# EAGLE design Carrier Board (EAGLE 9.5.1)

## Sheet 1 of 3: Sensors
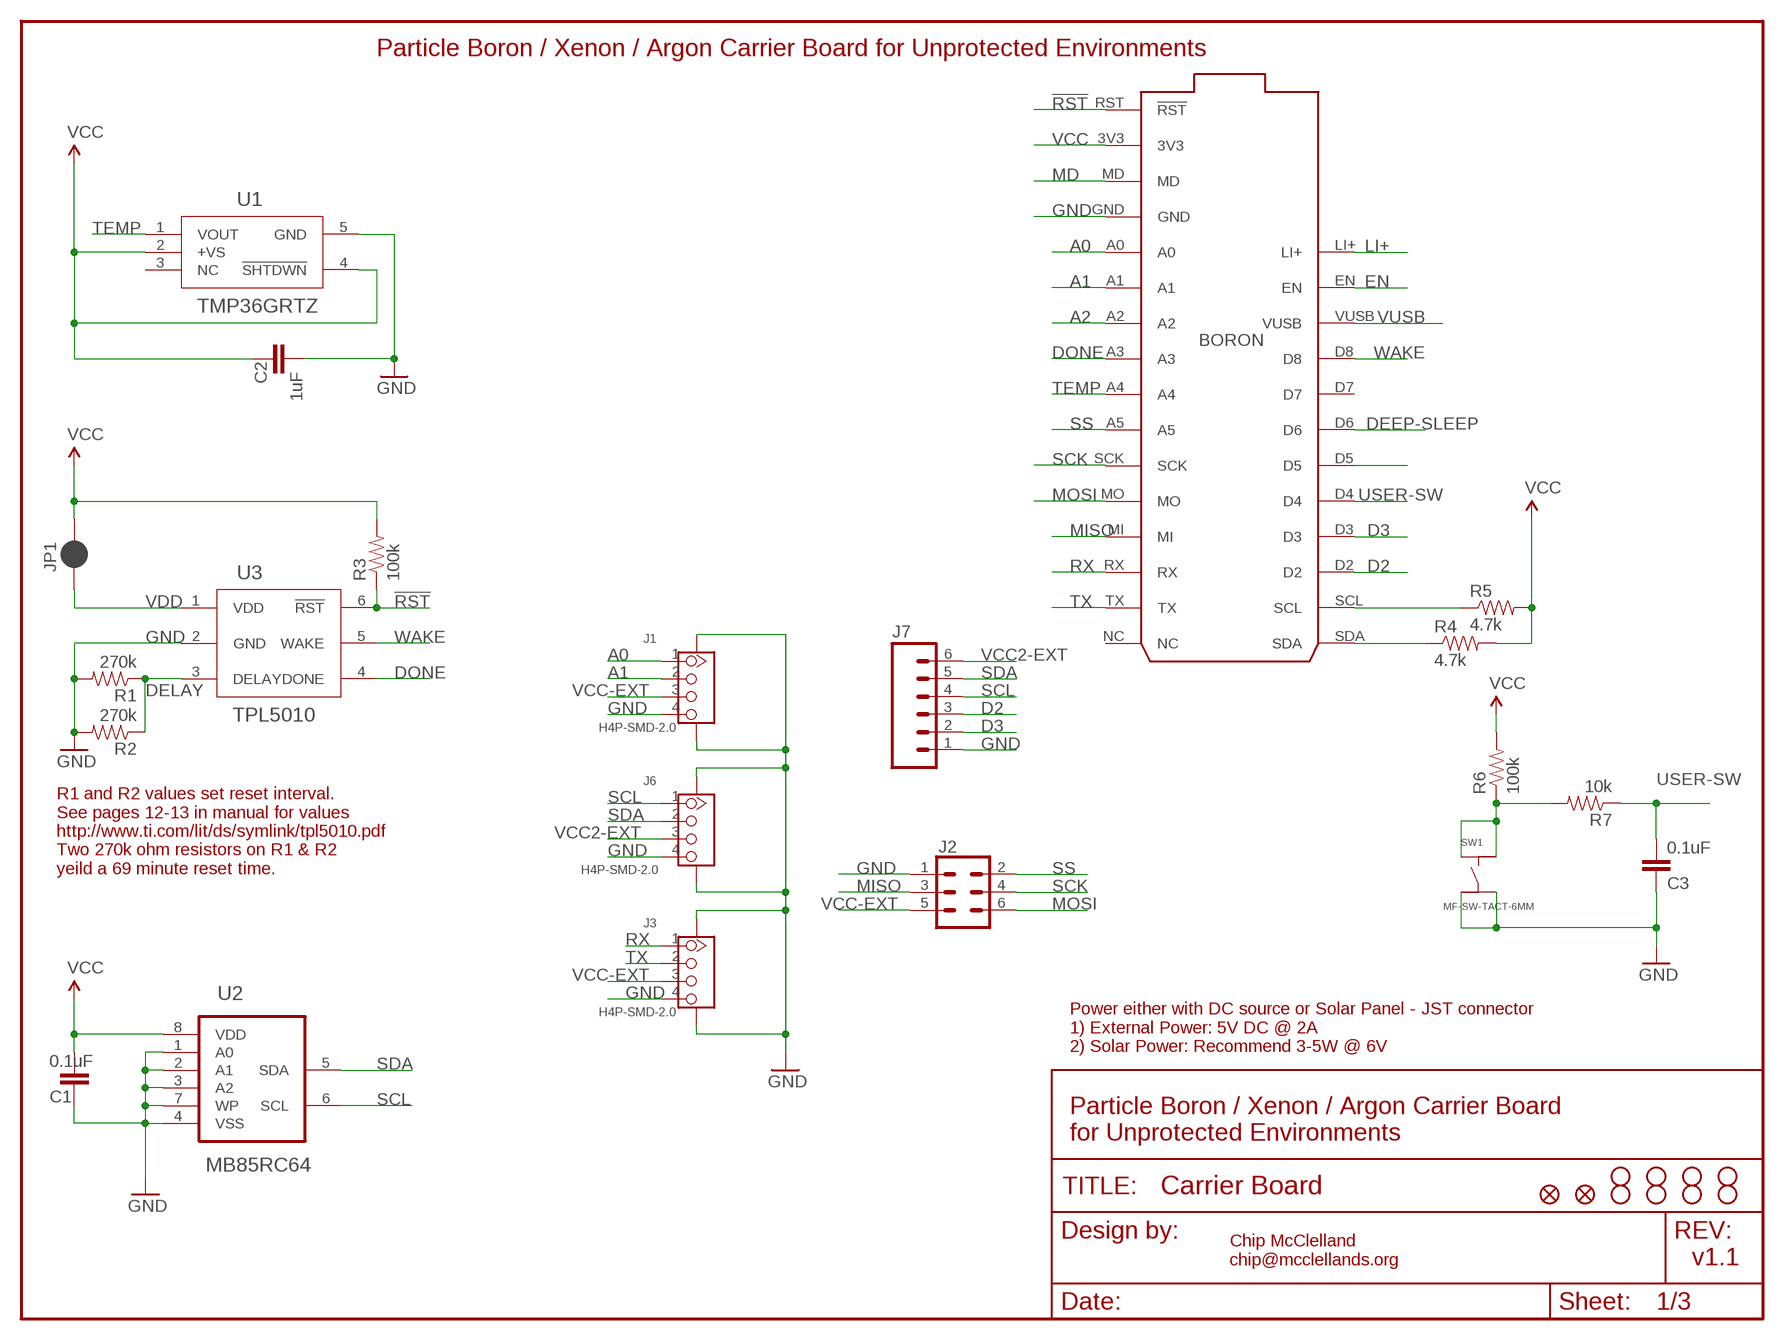
[diagram p0: schematic, sheet 1]

### Parts
C1  0.1uF  CAP0805  [0805@1]
C2  1uF  CAP0805  [0805@1]
C3  0.1uF  CAP0805  [0805@1]
FD1  FIDUCIALUFIDUCIAL  [FIDUCIAL-MICRO]
FD2  FIDUCIALUFIDUCIAL  [FIDUCIAL-MICRO]
FRAME1  FRAME-LETTER  [CREATIVE_COMMONS]
H1  STAND-OFF-M2.5  [STAND-OFF-M2.5]
H2  STAND-OFF-M2.5  [STAND-OFF-M2.5]
H3  STAND-OFF-M2.5  [STAND-OFF-M2.5]
H4  STAND-OFF-M2.5  [STAND-OFF-M2.5]
J1  H4P-SMD-2.0  GROVE-CONNECTOR-SMD(4+2P-2.0)  [HW4-SMD-2.0]
J2  CONN_03X22X3_SILK_MALE_PTH  [2X3]
J3  H4P-SMD-2.0  GROVE-CONNECTOR-SMD(4+2P-2.0)  [HW4-SMD-2.0]
J6  H4P-SMD-2.0  GROVE-CONNECTOR-SMD(4+2P-2.0)  [HW4-SMD-2.0]
J7  M06LOCK  [1X06_LOCK]
JP1  JUMPER-SMT_2_NC_PASTE_SILK  [SMT-JUMPER_2_NC_PASTE_SILK]
JP3  STAND-OFF  [STAND-OFF]
JP4  STAND-OFF  [STAND-OFF]
JP5  STAND-OFF  [STAND-OFF]
JP6  STAND-OFF  [STAND-OFF]
P1  PARTICLE-DEVICES-BORON  [PARTICLE-DEVICES_BORON]
R1  270k  RESISTOR0805-RES  [0805]
R2  270k  RESISTOR0805-RES  [0805]
R3  100k  RESISTOR0805-RES  [0805]
R4  4.7k  RESISTOR0805-RES  [0805]
R5  4.7k  RESISTOR0805-RES  [0805]
R6  100k  RESISTOR0805-RES  [0805]
R7  10k  RESISTOR0805-RES  [0805]
SW1  MF-SW-TACT-6MM  TACT_6MM  [TACT6MM]
U1  TMP36GRTZ  TMP36GRTZ-REEL7  [RJ_5]
U2  MB85RC64  MB85RC128PNF-G-JNE1  [SOIC127P600X175-8N]
U3  TPL5010  [TSOT-23]

### Nets
!RST: P1.RST(!RST) R3.1 U3.6(!RST)
A0: J1.1 P1.A0
A1: J1.2 P1.A1
A2: P1.A2
D2: J7.3 P1.D2 ; also sheet 2
D3: J7.2 P1.D3 ; also sheet 2
DEEP-SLEEP: P1.D6 ; also sheet 3
DELAY: R1.1 R2.1 U3.3(DELAY)
DONE: P1.A3 U3.4(DONE)
EN: P1.EN ; also sheet 3
GND: C1.2 C2.2 C3.2 J1.4 J1.SS1 J1.SS2 J2.1 J3.4 J3.SS1 J3.SS2 J6.4 J6.SS1 J6.SS2 J7.1 P1.GND R1.2 R2.2 SW1.P$3 SW1.P$4 U1.5(GND) U2.1(A0) U2.2(A1) U2.3(A2) U2.4(VSS) U2.7(WP) U3.2(GND) ; also sheet 2,3
LI+: P1.LI+ ; also sheet 2,3
MD: P1.MD
MISO: J2.3 P1.MI
MOSI: J2.6 P1.MO
N$2: P1.D5
N$4: R6.1 R7.2 SW1.P$1 SW1.P$2
RX: J3.1 P1.RX
SCK: J2.4 P1.SCK
SCL: J6.1 J7.4 P1.SCL R5.1 U2.6(SCL) ; also sheet 2,3
SDA: J6.2 J7.5 P1.SDA R4.1 U2.5(SDA) ; also sheet 2,3
SS: J2.2 P1.A5
TEMP: P1.A4 U1.1(VOUT)
TX: J3.2 P1.TX
USER-SW: C3.1 P1.D4 R7.1
VCC: C1.1 C2.1 JP1.2 P1.3V3 R3.2 R4.2 R5.2 R6.2 U1.2(+VS) U1.4(!SHTDWN) U2.8(VDD) ; also sheet 2,3
VCC2-EXT: J6.3 J7.6 ; also sheet 2
VCC-EXT: J1.3 J2.5 J3.3 ; also sheet 2
VDD: JP1.1 U3.1(VDD)
VUSB: P1.VUSB ; also sheet 2
WAKE: P1.D8 U3.5(WAKE)
Unconnected: P1.D7 P1.NC U1.3(NC)

### Notes on the sheet
- Particle Boron / Xenon / Argon Carrier Board for Unprotected Environments
- R1 and R2 values set reset interval.
  See pages 12-13 in manual for values
  http://www.ti.com/lit/ds/symlink/tpl5010.pdf
  Two 270k ohm resistors on R1 & R2 
  yeild a 69 minute reset time.
- Power either with DC source or Solar Panel - JST connector
  1) External Power: 5V DC @ 2A 
  2) Solar Power: Recommend 3-5W @ 6V
- Particle Boron / Xenon / Argon Carrier Board
  for Unprotected Environments
- Chip McClelland
  chip@mcclellands.org
- v1.1

## Sheet 2 of 3: Power Control
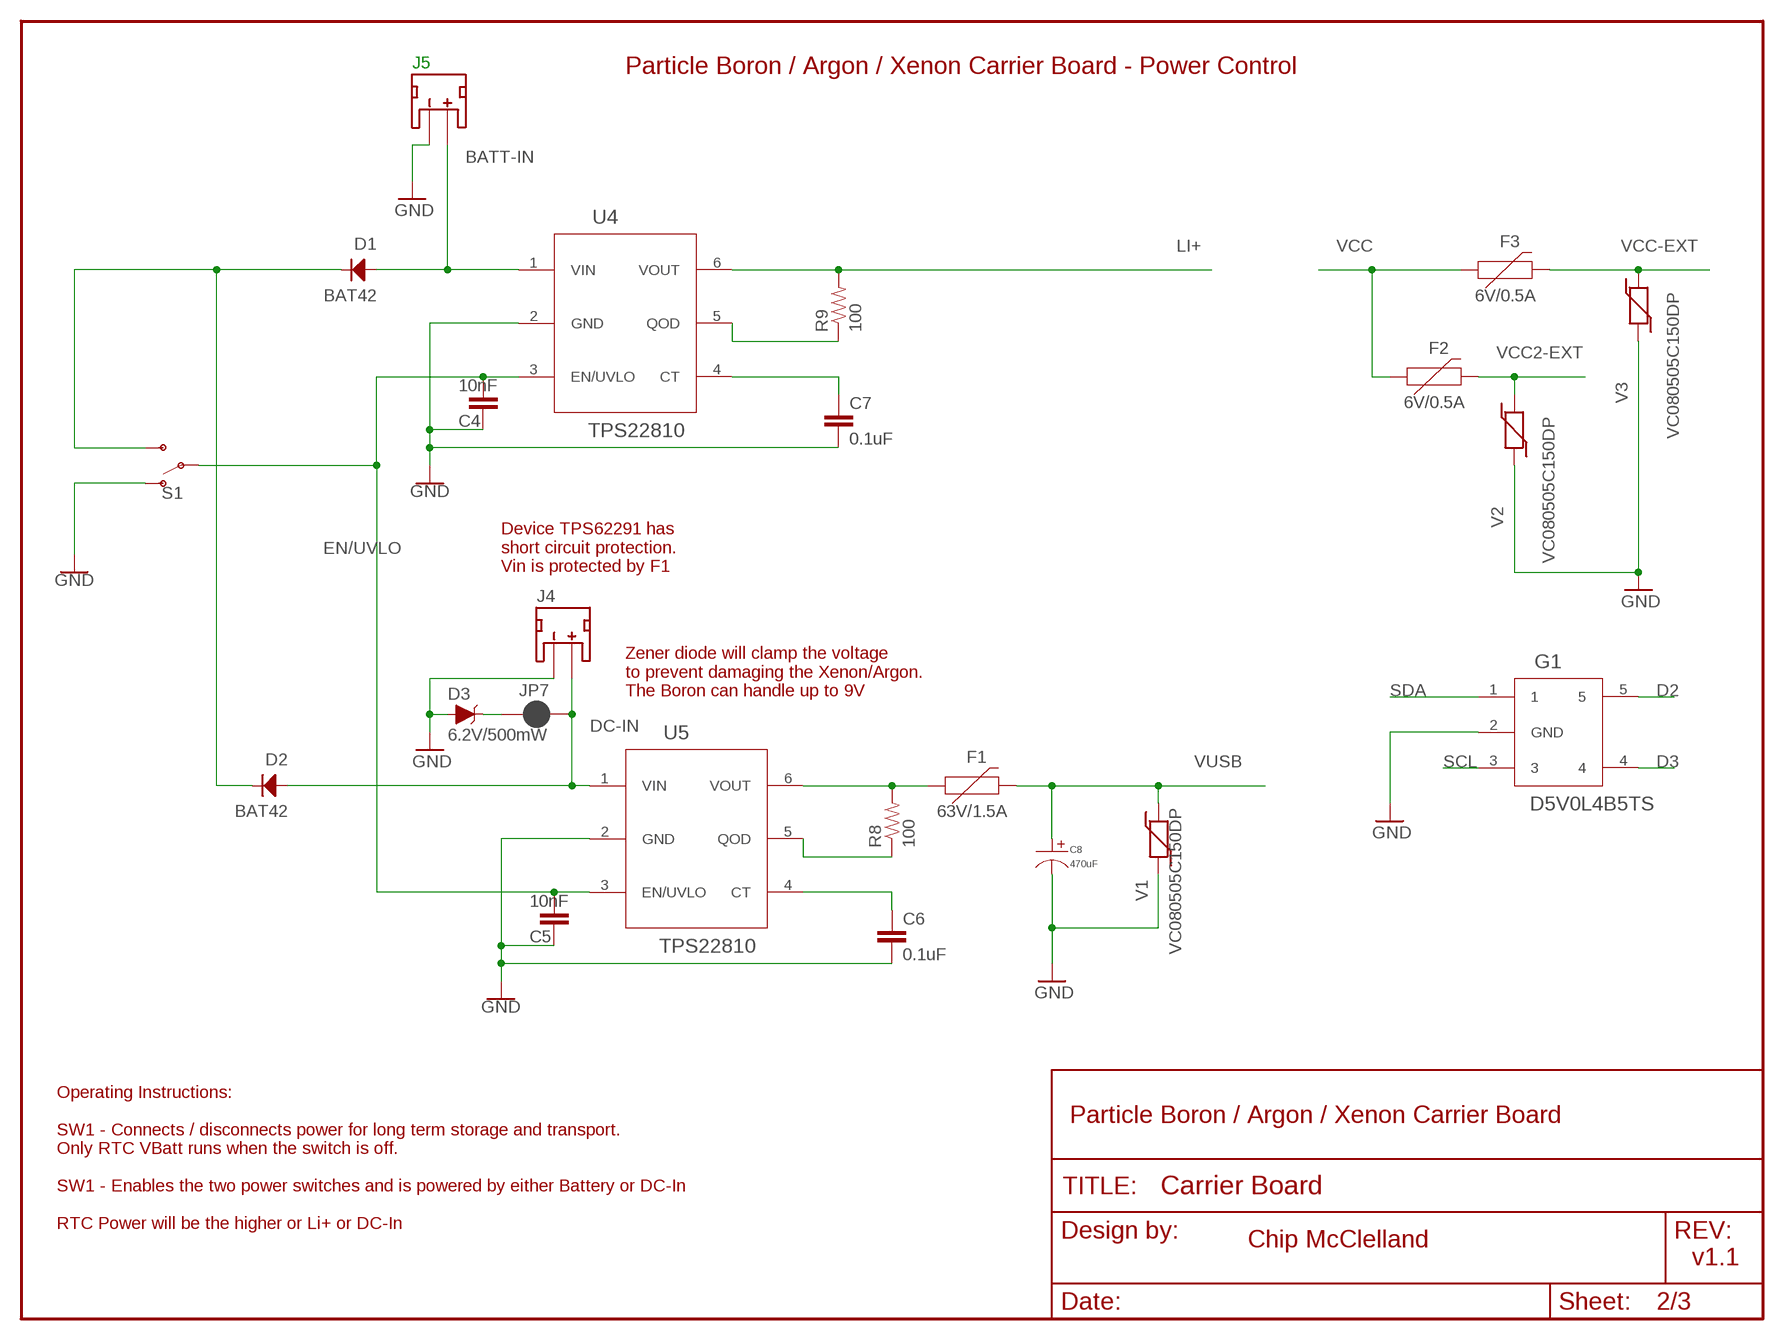
[diagram p1: schematic, sheet 2]

### Parts
C4  10nF  CAP0805  [0805@1]
C5  10nF  CAP0805  [0805@1]
C6  0.1uF  CAP0805  [0805@1]
C7  0.1uF  CAP0805  [0805@1]
C8  470uF  CAPACITOR_P_10MM  [CP10MM]
D1  BAT42  DIODES_BAT42_SOD-123  [SOD-123]
D2  BAT42  DIODES_BAT42_SOD-123  [SOD-123]
D3  6.2V/500mW  DIODE-ZENER-DZ2J150M0L  [PANASONIC_SMINI2-F5-B]
F1  63V/1.5A  PPTC_HALF-AMP  [1206]
F2  6V/0.5A  PPTC_HALF-AMP  [1206]
F3  6V/0.5A  PPTC_HALF-AMP  [1206]
FRAME2  FRAME-LETTER  [CREATIVE_COMMONS]
G1  D5V0L4B5TS  [SOT-23-5]
J4  S2B-PH-SM4-TB(LF)(SN)  JST_2MM_MALE  [JST-2-SMD]
J5  S2B-PH-SM4-TB(LF)(SN)  JST_2MM_MALE  [JST-2-SMD]
JP7  JUMPER-SMT_2_NC_PASTE_SILK  [SMT-JUMPER_2_NC_PASTE_SILK]
R8  100  RESISTOR0805-RES  [0805]
R9  100  RESISTOR0805-RES  [0805]
S1  SWITCH-SPDT-SMD-AYZ0202  [SWITCH_DPDT_SMD_AYZ0202]
U4  TPS22810  [SOT-23-6]
U5  TPS22810  [SOT-23-6]
V1  VC080505C150DP  VARISTOR  [0805]
V2  VC080505C150DP  VARISTOR  [0805]
V3  VC080505C150DP  VARISTOR  [0805]

### Nets
BATT-IN: D1.ANODE J5.2(+) U4.1(VIN) ; also sheet 3
D2: G1.5 ; also sheet 1
D3: G1.4 ; also sheet 1
DC-IN: D2.ANODE J4.2(+) JP7.1 U5.1(VIN)
EN/UVLO: C4.1 C5.1 S1.2(P) U4.3(EN/UVLO) U5.3(EN/UVLO)
GND: C4.2 C5.2 C6.2 C7.2 C8.P$2 D3.A G1.2(GND) J4.1(-) J5.1(-) S1.1(O) U4.2(GND) U5.2(GND) V1.1 V2.1 V3.1 ; also sheet 1,3
LI+: R9.2 U4.6(VOUT) ; also sheet 1,3
N$1: D3.C JP7.2
N$5: C6.1 U5.4(CT)
N$6: R8.1 U5.5(QOD)
N$7: F1.1 R8.2 U5.6(VOUT)
N$9: D1.CATHODE D2.CATHODE S1.3(S)
N$10: C7.1 U4.4(CT)
N$12: R9.1 U4.5(QOD)
SCL: G1.3 ; also sheet 1,3
SDA: G1.1 ; also sheet 1,3
VCC: F2.1 F3.1 ; also sheet 1,3
VCC2-EXT: F2.2 V2.2 ; also sheet 1
VCC-EXT: F3.2 V3.2 ; also sheet 1
VUSB: C8.P$1 F1.2 V1.2 ; also sheet 1
Unconnected: J4.NC1(PAD1) J4.NC2(PAD2) J5.NC1(PAD1) J5.NC2(PAD2)

### Notes on the sheet
- Particle Boron / Argon / Xenon Carrier Board - Power Control
- Device TPS62291 has 
  short circuit protection. 
  Vin is protected by F1
- Zener diode will clamp the voltage
  to prevent damaging the Xenon/Argon.  
  The Boron can handle up to 9V
- Particle Boron / Argon / Xenon Carrier Board
- Operating Instructions:
  
  SW1 - Connects / disconnects power for long term storage and transport.  
  Only RTC VBatt runs when the switch is off.
  
  SW1 - Enables the two power switches and is powered by either Battery or DC-In
  
  RTC Power will be the higher or Li+ or DC-In
- Chip McClelland
- v1.1

## Sheet 3 of 3: Real Time Clock
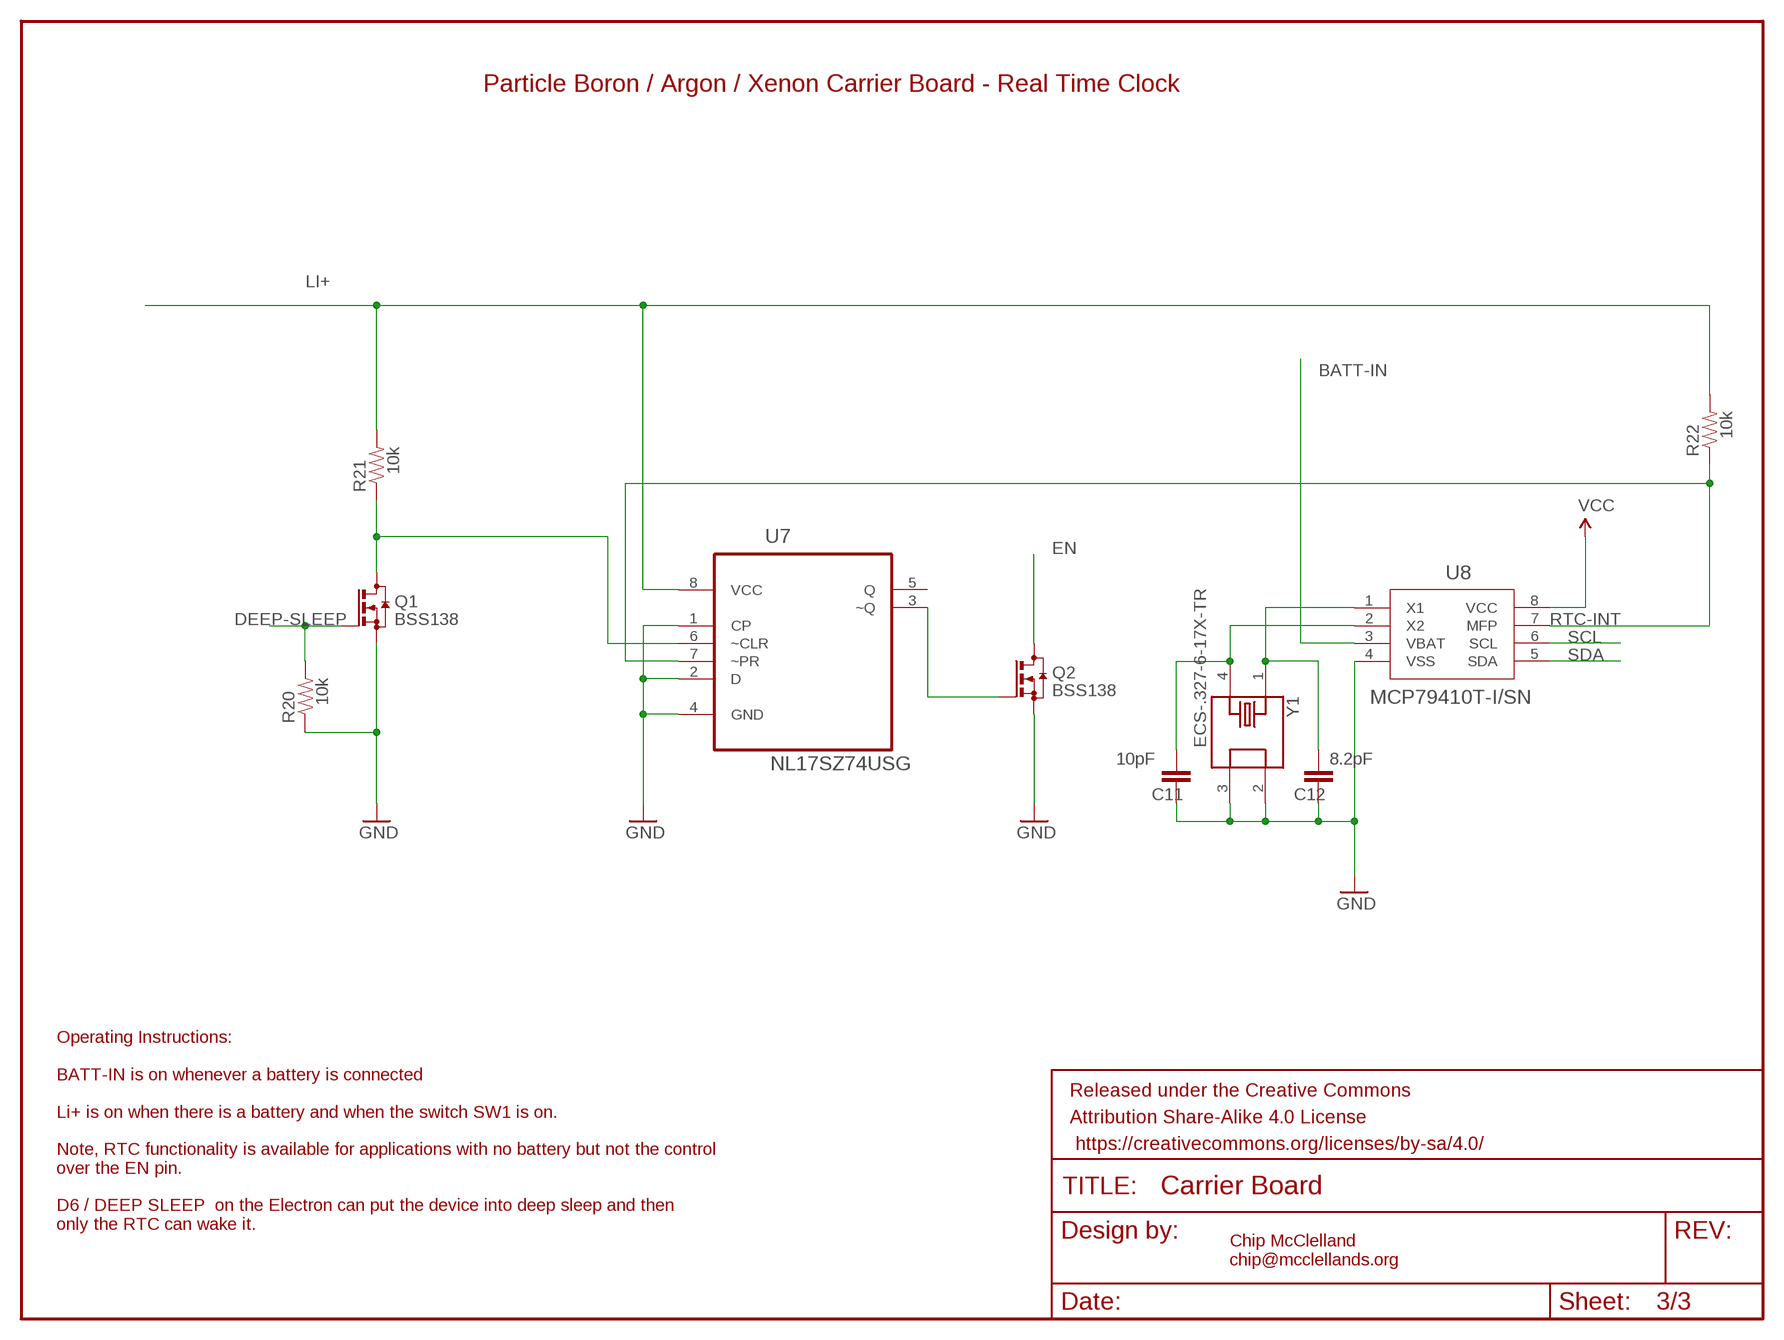
[diagram p2: schematic, sheet 3]

### Parts
C11  10pF  CAP0805  [0805@1]
C12  8.2pF  CAP0805  [0805@1]
FRAME3  FRAME-LETTER  [CREATIVE_COMMONS]
Q1  BSS138  BSS123  [SOT23]
Q2  BSS138  BSS123  [SOT23]
R20  10k  RESISTOR0805-RES  [0805]
R21  10k  RESISTOR0805-RES  [0805]
R22  10k  RESISTOR0805-RES  [0805]
U7  NL17SZ74USG  [SOP50P310X90-8N]
U8  MCP79410T-I/SN  [SOIC8-N_MC]
Y1  ECS-.327-6-17X-TR  [XTAL_ECS-.327-6-17X-TR]

### Nets
BATT-IN: U8.3(VBAT) ; also sheet 2
DEEP-SLEEP: Q1.1(G) R20.2 ; also sheet 1
EN: Q2.3(D) ; also sheet 1
GND: C11.2 C12.2 Q1.2(S) Q2.2(S) R20.1 U7.1(CP) U7.2(D) U7.4(GND) U8.4(VSS) Y1.2 Y1.3 ; also sheet 1,2
LI+: R21.2 R22.2 U7.8(VCC) ; also sheet 1,2
N$13: Q2.1(G) U7.3(~Q)
N$14: Q1.3(D) R21.1 U7.6(~CLR)
N$15: C12.1 U8.1(X1) Y1.1
N$16: C11.1 U8.2(X2) Y1.4
RTC-INT: R22.1 U7.7(~PR) U8.7(MFP)
SCL: U8.6(SCL) ; also sheet 1,2
SDA: U8.5(SDA) ; also sheet 1,2
VCC: U8.8(VCC) ; also sheet 1,2
Unconnected: U7.5(Q)

### Notes on the sheet
- Particle Boron / Argon / Xenon Carrier Board - Real Time Clock
- Operating Instructions:
  
  BATT-IN is on whenever a battery is connected
  
  Li+ is on when there is a battery and when the switch SW1 is on.
  
  Note, RTC functionality is available for applications with no battery but not the control
  over the EN pin.
  
  D6 / DEEP SLEEP  on the Electron can put the device into deep sleep and then 
  only the RTC can wake it.
- Chip McClelland
  chip@mcclellands.org

## Library data of the parts
C1 = SparkFun-Capacitors:CAP: Capacitor Standard 0603 ceramic capacitor, and 0.1" leaded capacitor.; HOUSEPART: YES; MPN: MF-CAP-0805-0.1uF; POPULATE: 1
C2 = SparkFun-Capacitors:CAP: Capacitor Standard 0603 ceramic capacitor, and 0.1" leaded capacitor.; MPN: MF-CAP-0805-1uF
C3 = SparkFun-Capacitors:CAP: Capacitor Standard 0603 ceramic capacitor, and 0.1" leaded capacitor.; MPN: MF-CAP-0805-0.1uF; POPULATE: 1
C4 C5 = SparkFun-Capacitors:CAP: Capacitor Standard 0603 ceramic capacitor, and 0.1" leaded capacitor.; HOUSEPART: No; MPN: 08051C103K4T2A; POPULATE: 1
C6 C7 = SparkFun-Capacitors:CAP: Capacitor Standard 0603 ceramic capacitor, and 0.1" leaded capacitor.; HOUSEPART: Yes; MPN: MF-CAP-0805-0.1uF
C8 = MF_Passives:CAPACITOR_P: Library: MF_Passives Description: Device for Polarized Capacitors. Manufacture part number (MPN), Voltage Rating, and Tolerance can be added via Attributes. Check https://factory.macrofab.com/parts for the house parts list.; HOUSEPART: 1; MPN: MF-CAP-10MM-470uF; POPULATE: 1
C11 = SparkFun-Capacitors:CAP: Capacitor Standard 0603 ceramic capacitor, and 0.1" leaded capacitor.; HOUSEPART: No; MPN: C0805C100JDGACTU‎; POPULATE: 1
C12 = SparkFun-Capacitors:CAP: Capacitor Standard 0603 ceramic capacitor, and 0.1" leaded capacitor.; HOUSEPART: No; MPN: C0805C829D5GACTU‎; POPULATE: 1
D1 D2 = MF_Discrete_Semiconductor:DIODES: Library: MF_Discrete_Semiconductor Description: Device for Single Packaged Diodes.; HOUSEPART: YES; MPN: MF-DIO-SOD123-BAT42; POPULATE: 1; URL: https://factory.macrofab.com/part/MF-DIO-SOD123-BAT42; VALUE: MF-DIO-SOD123-BAT42
D3 = SparkFun-DiscreteSemi:DIODE-ZENER: Zener Diode A Zener diode allows current to flow from its anode to its cathode like a normal semiconductor diode, but it also permits current to flow in the reverse direction when its "Zener voltage" is reached. - WIkipedia; MPN: TDZ6V2J,115; POPULATE: 1; PROD_ID: DIO-12989; VALUE: 15V
F1 = SparkFun-Fuses:PPTC: Resettable Fuse PPTC Resettable Fuse. Really a sort of resistor with a polymeric positive temperature coefficient whose resistance increases dramatically with an increase in temperature. When heated by the power passing through the resistance rises causing the current to be limited, protecting the circuit. This is achieved by the transition of the polymer from a crystalline to an amorphous state where the conductive carbon separates breaking the conductive pathways found in the cool crystalline structure. When a PPTC cools back down it resumes conducting letting the circuit turn back on. SparkFun Products: SparkFun RedBoard - Programmed with Arduino <https://www.sparkfun.com/products/12757> Pro Micro - 5V/16MHz <https://www.sparkfun.com/products/12640> Arduino Pro 328 - 5V/16MHz <https://www.sparkfun.com/products/10915> MP3 Trigger <https://www.sparkfun.com/products/13720>; MPN: 046801.5NR; PROD_ID: RES-08585; VALUE: 6V/0.5A
F2 F3 = SparkFun-Fuses:PPTC: Resettable Fuse PPTC Resettable Fuse. Really a sort of resistor with a polymeric positive temperature coefficient whose resistance increases dramatically with an increase in temperature. When heated by the power passing through the resistance rises causing the current to be limited, protecting the circuit. This is achieved by the transition of the polymer from a crystalline to an amorphous state where the conductive carbon separates breaking the conductive pathways found in the cool crystalline structure. When a PPTC cools back down it resumes conducting letting the circuit turn back on. SparkFun Products: SparkFun RedBoard - Programmed with Arduino <https://www.sparkfun.com/products/12757> Pro Micro - 5V/16MHz <https://www.sparkfun.com/products/12640> Arduino Pro 328 - 5V/16MHz <https://www.sparkfun.com/products/10915> MP3 Trigger <https://www.sparkfun.com/products/13720>; MPN: 0466.500NR; PROD_ID: RES-08585
FD1 FD2 = SparkFun-Aesthetics:FIDUCIAL: Fiducial Alignment Points Point-of-reference for pick-and-place machines and other optical instruments.; POPULATE: 0
FRAME1-FRAME3 = SparkFun-Aesthetics:FRAME-LETTER: Schematic Frame - Letter Standard 8.5x11 US Letter frame; POPULATE: 0
G1 = Custom Components:D5V0L4B5TS: 4 CHANNEL LOW CAPACITANCE BI-DIRECTIONAL TVS ARRAY; MPN: D5V0L4B5TS-7
H1-H4 = Custom Components:STAND-OFF-M2.5: Stand Off Drill holes for mechanically mounting via screws, standoffs, etc. Note: Use the keepout ring to avoid running the screw head into surrounding components. Variant Overviews STAND-OFF - Mechanical footprint for a M2.5 phillips button head screw. STAND-OFF-TIGHT - Mechanical footprint for a M2.5 phillips button head screw, Example SparkFun Products; POPULATE: 0
J1 J3 J6 = OPL_Connector:GROVE-CONNECTOR-SMD(4+2P-2.0): 320110030; MPN: B4B-PH-SM4-TB(LF)(SN); POPULATE: 1
J2 = SparkFun-Connectors:CONN_03X2: Multi connection point. Often used as Generic Header-pin footprint for 0.1 inch spaced/style header connections You can populate with any combo of single row headers, but if you'd like an exact match, check these: Header - 2x3 (Male, 0.1") <https://www.sparkfun.com/products/12807> (PRT-12807) Header - 2x3 (Female, 0.1") <https://www.sparkfun.com/products/13010> (PRT-13010) 2x3 Pin Shrouded Header <https://www.sparkfun.com/products/10877> (PRT-10877) On any of the 0.1 inch spaced packages, you can populate with these: Break Away Headers - Straight <https://www.sparkfun.com/products/116> (PRT-00116) Break Away Male Headers - Right Angle <https://www.sparkfun.com/products/553> (PRT-00553) Female Headers <https://www.sparkfun.com/products/115> (PRT-00115) Break Away Headers - Machine Pin <https://www.sparkfun.com/products/117> (PRT-00117) Break Away Female Headers - Swiss Machine Pin <https://www.sparkfun.com/products/743> (PRT-00743) Special note: the shrouded connector mates well with our 3x2 ribbon cables: Ribbon Crimp Connector - 6-pin (2x3, Female) <https://www.sparkfun.com/products/10651> (PRT-10651) Ribbon Cable - 6 wire (15ft) <https://www.sparkfun.com/products/10646> (PRT-10646); POPULATE: 0; PROD_ID: CONN-09701
J4 J5 = SparkFun-Connectors:JST_2MM_MALE: JST 2MM MALE RA CONNECTOR Two pin, compact surface mount connector. Commonly used as a battery input connection point. We really like the solid locking feeling and high current rating on these small connectors. We use these all the time as battery connectors. Mates to single-cell LiPo batteries. Here is the connector we sell at SparkFun: JST Right Angle Connector - White <https://www.sparkfun.com/products/8612> (PRT-08612) Datasheet <http://www.sparkfun.com/datasheets/Prototyping/Connectors/JST-Horizontal.pdf> It was used on these SparkFun products: SparkFun MOSFET Power Controller <https://www.sparkfun.com/products/11214> (PRT-11214) SparkFun Battery Babysitter - LiPo Battery Manager <https://www.sparkfun.com/products/13777> (PRT-13777) And many, many others that required a lipo battery connection.; MFG: JST S2B-PH-SM4-TB(LF)(SN); PROD_ID: CONN-11443; SF_ID: PRT-08612
J7 = SparkFun-Connectors:M06: Header 6 Standard 6-pin 0.1" header. Use with straight break away headers (SKU : PRT-00116), right angle break away headers (PRT-00553), swiss pins (PRT-00743), machine pins (PRT-00117), and female headers (PRT-00115). Molex polarized connector foot print use with SKU : PRT-08094 with associated crimp pins and housings. NOTES ON THE VARIANTS LOCK and LOCK_LONGPADS... This footprint was designed to help hold the alignment of a through-hole component (i.e. 6-pin header) while soldering it into place. You may notice that each hole has been shifted either up or down by 0.005 of an inch from it's more standard position (which is a perfectly straight line). This slight alteration caused the pins (the squares in the middle) to touch the edges of the holes. Because they are alternating, it causes a "brace" to hold the component in place. 0.005 has proven to be the perfect amount of "off-center" position when using our standard breakaway headers. Although looks a little odd when you look at the bare footprint, once you have a header in there, the alteration is very hard to notice. Also,if you push a header all the way into place, it is covered up entirely on the bottom side. This idea of altering the position of holes to aid alignment will be further integrated into the Sparkfun Library for other footprints. It can help hold any component with 3 or more connection pins.; POPULATE: 0
JP1 JP7 = SparkFun-Jumpers:JUMPER-SMT_2_NC_PASTE: Normally closed solder jumper This jumper has an aperture in the stencil to allow solder paste to bridge the split in the wire so it's normally closed (NC). Wick off the solder to open the connection. Reapply solder to reclose the connection.; POPULATE: 0
JP3-JP6 = SparkFun-Hardware:STAND-OFF: Stand Off Drill holes for mechanically mounting via screws, standoffs, etc. Note: Use the keepout ring to avoid running the screw head into surrounding components. Variant Overviews STAND-OFF - Mechanical footprint for a #4 phillips button head screw. STAND-OFF-TIGHT - Mechanical footprint for a #4 phillips button head screw, Example SparkFun Products Screw - Phillips Head (1/4", 4-40, 10 pack) <https://www.sparkfun.com/products/10453> (PRT-10453) Screw - Phillips Head (1/2", 4-40, 10 pack) <https://www.sparkfun.com/products/10452> (PRT-10452) Screw - Phillips Head (3/4", 4-40, 10 pack) <https://www.sparkfun.com/products/10451> (PRT-10451) Screw - Phillips Head (1", 4-40, 10 pack) <https://www.sparkfun.com/products/10450> (PRT-10450); POPULATE: 0
P1 = Carrier Board:PARTICLE-DEVICES-BORON: Particle Boron Device for Carrier Board Placement; POPULATE: 0
Q1 Q2 = transistor-small-signal:BSS123: N-CHANNEL MOS FET; HOUSEPART: Yes; MPN: MF-DSC-SOT233-BSS138
R1 R2 = SparkFun-Passives:RESISTOR: Resistor Basic schematic elements and footprints for 0603, 1206, and PTH resistors.; MPN: ERJ-P06F2703V
R3 R6 = SparkFun-Passives:RESISTOR: Resistor Basic schematic elements and footprints for 0603, 1206, and PTH resistors.; HOUSEPART: YES; MPN: MF-RES-0805-100K
R4 R5 = SparkFun-Passives:RESISTOR: Resistor Basic schematic elements and footprints for 0603, 1206, and PTH resistors.; MPN: MF-RES-0805-4.7K
R7 R20-R22 = SparkFun-Passives:RESISTOR: Resistor Basic schematic elements and footprints for 0603, 1206, and PTH resistors.; HOUSEPART: YES; MPN: MF-RES-0805-10K
R8 R9 = SparkFun-Passives:RESISTOR: Resistor Basic schematic elements and footprints for 0603, 1206, and PTH resistors.; HOUSEPART: Yes; MPN: MF-RES-0805-100
S1 = SparkFun-Switches:SWITCH-SPDT: Single Pole, Double Throw (SPDT) Switch Single-pole, double-throw (SPDT) switch. Variant Overview SMD-AYZ0202 Surface Mount DPDT Switch <https://www.sparkfun.com/products/597> (COM-00597) Used on e.g. LilyPad Arduino USB - ATmega32U4 Board <https://www.sparkfun.com/products/12049> PTH-11.6X4.0MM SPDT Mini Power Switch <https://www.sparkfun.com/products/102> (COM-00102) Used on e.g. SparkFun Simon Says - Through-Hole Soldering Kit <https://www.sparkfun.com/products/10547> (KIT-10547) PTH-11.6X4.0MM-KIT KIT version of SPDT Mini Power Switch - Simplifies soldering by removing tStop of switch pins - only one side can be soldered. PTH-11.6X4.0MM-LOCK LOCK version of SPDT Mini Power Switch - Offset pins hold switch in place for easier soldering. SMD-RIGHT-ANGLE Surface Mount Right Angle Switch <https://www.sparkfun.com/products/10860> (COM-10860) Used on e.g. SparkFun ESP8266 Thing <https://www.sparkfun.com/products/13231>; MPN: AYZ0202AGRLC; PROD_ID: SWCH-08179; SF_ID: COM-00597
SW1 = MF_Switches:TACT: Library: MF_Switches Description: Device for Tact Switches. Manufacture part number (MFG#) can be added via Attributes.; HOUSEPART: YES; MPN: MF-SW-TACT-6MM; POPULATE: 1; URL: https://factory.macrofab.com/part/MF-SW-TACT-6MM
U1 = TMP36:TMP36GRTZ-REEL7; MANUFACTURER_PART_NUMBER: TMP36GRTZ-REEL7; MPN: TMP36GRTZ-REEL7; VENDOR: Analog Devices Inc
U2 = Fujitsu_By_element14_Batch_1:MB85RC128PNF-G-JNE1: Memory FRAM; MPN: MB85RC64PNF-G-JNE1; OC_FARNELL: 1831995; OC_NEWARK: 93R5161; PACKAGE: SO-8; SUPPLIER: FUJITSU
U3 = Custom Components:TPL5010: This is a TI Ultra-Low-Power External watchdog.; MPN: TPL5010DDCR; POPULATE: 1
U4 U5 = Custom Components:TPS22810: TPS22810, 2.7-18-V, 79-mΩOn-ResistanceLoadSwitchWithThermal Protection; MPN: TPS22810DBVT
U7 = Custom Components:NL17SZ74USG: Single D Flip Flop; DESCRIPTION: NL17SZ Series 3.25 V Surface Mount Single D-Type Flip-Flop - US-8; DIGI-KEY_PART_NUMBER: NL17SZ74USGOSCT-ND; DIGI-KEY_PURCHASE_URL: https://www.digikey.com/product-detail/en/on-semiconductor/NL17SZ74USG/NL17SZ74USGOSCT-ND/1139964?utm_source=snapeda&utm_medium=aggregator&utm_campaign=symbol; MF: ON Semiconductor; MP: NL17SZ74USG; PACKAGE: VFSOP-8 ON Semiconductor
U8 = Custom Components:MCP79410T-I/SN; MANUFACTURER_PART_NUMBER: MCP79410TISN; POPULATE: 1; VENDOR: Microchip
V1-V3 = Custom Components:VARISTOR; MPN: VC080505C150DP
Y1 = Custom Components:ECS-.327-6-17X-TR: Crystal 4-SOJ, 5.50mm pitch; DESCRIPTION: ECX-306X Series 32.768 kHz ±20 ppm 6 pF -40 to +85 °C SMT Tuning Fork Crystal; DIGI-KEY_PART_NUMBER: XC1307CT-ND; DIGI-KEY_PURCHASE_URL: https://www.digikey.com/product-detail/en/ecs-inc/ECS-.327-6-17X-TR/XC1307CT-ND/827771?utm_source=snapeda&utm_medium=aggregator&utm_campaign=symbol; MF: ECS Inc.; MP: ECS-.327-6-17X-TR; PACKAGE: 4-4 ECS International

## Net classes
0 default: width 0.203 mm, drill 0.33 mm

## Board
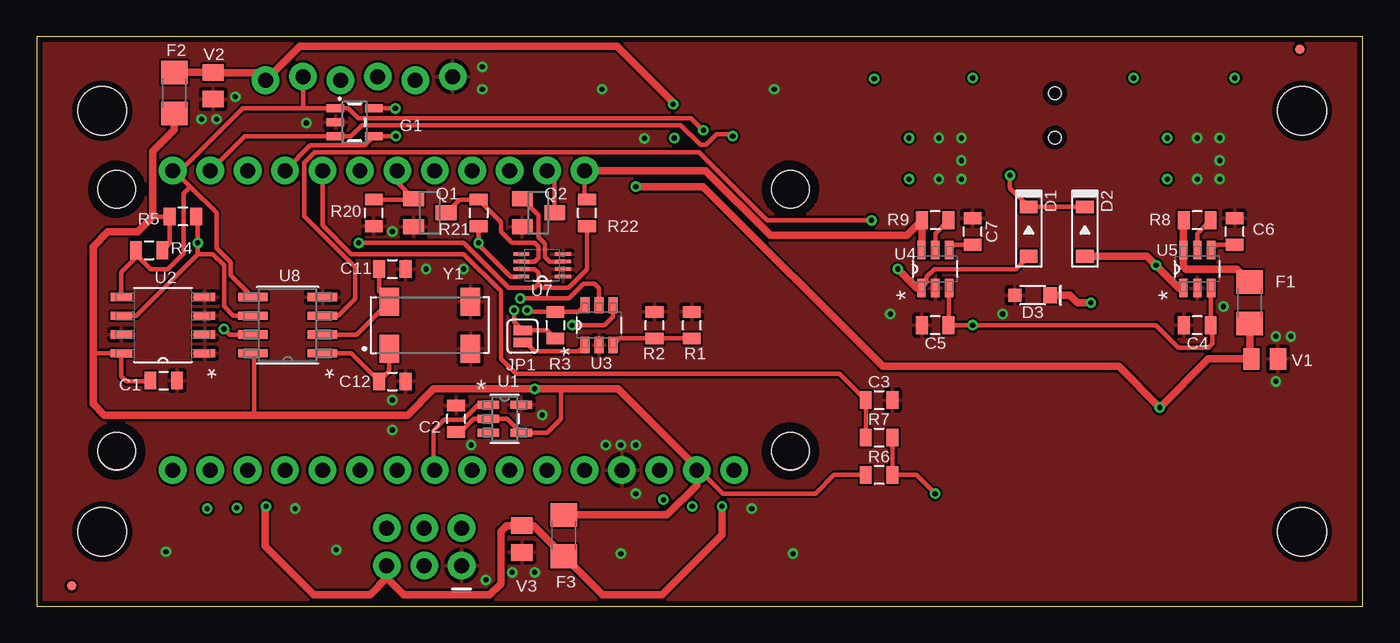
[diagram p3: board, top side]
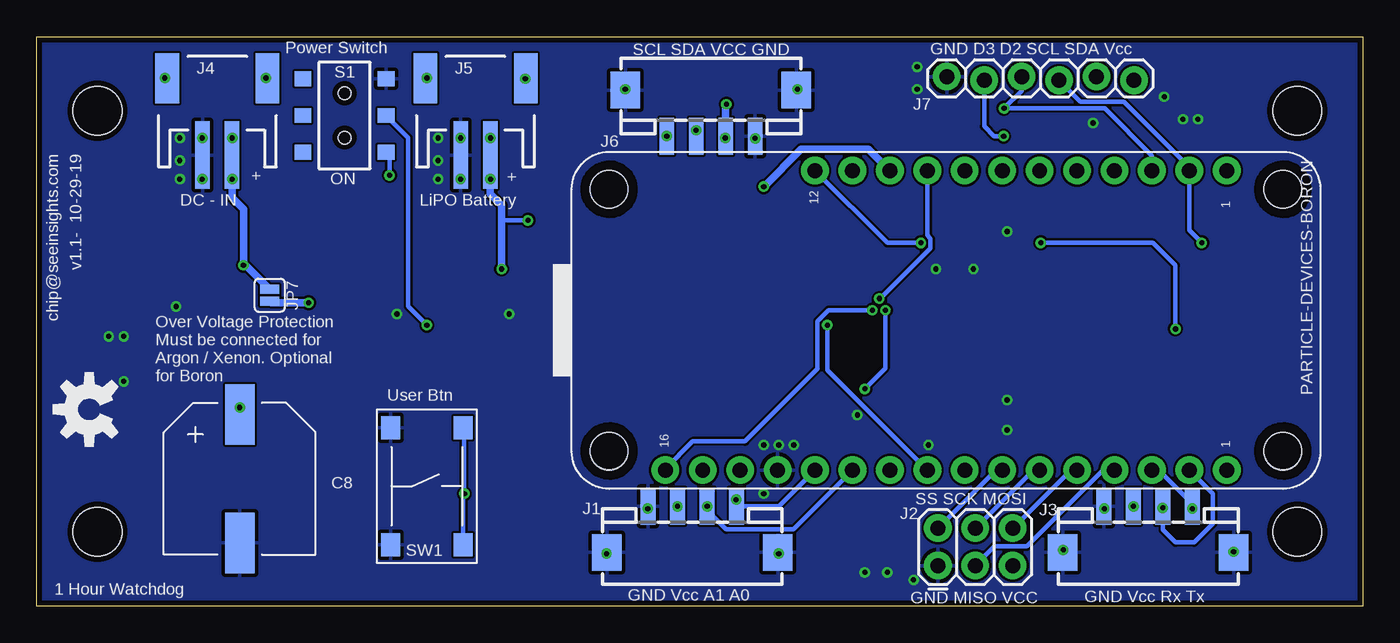
[diagram p4: board, bottom side, seen from below]

Size 89.97 x 38.61 mm. Coordinates in mm from the lower left corner, seen from the top.
Outline: 0,0 89.97,0 89.97,38.61 0,38.61 0,0
Copper layers (1*16): Top 0.0356mm / dielectric 1.5011mm / Bottom 0.0356mm
Design rules "LaenPCBOrder": minimum track width 6mil, minimum drill 13mil, track to track 6mil, track to pad 6mil, pad to pad 6mil, via to via 6mil, smd to smd 6mil, copper to edge 15mil, drill to drill 6mil, minimum pad ring 7mil, minimum via ring 7mil, stop-mask expansion 3mil, vias tented up to drill 0mil, thermal gap 10mil

### Footprints (pad centres in the part's own frame; a part is rotated, then mirrored left to right if it is on the bottom)
0805@1 = smd 0.8 x 1.2: 1 -0.9,0; 2 0.9,0
CP10MM = smd 2 x 4.1: P$1 0,-4.35; P$2 0,4.35
SOD-123 = smd 0.85 x 1.2: ANODE 1.675,0; CATHODE -1.675,0
PANASONIC_SMINI2-F5-B = smd 0.9 x 0.9: A 1.2,0 | smd 0.9 x 1.1: C -1.2,0
1206 = smd 1.6 x 1.8: 1 -1.4,0; 2 1.4,0
FIDUCIAL-MICRO = smd 0.635 x 0.635: 1 0,0
SOT-23-5 = smd 0.55 x 1.2: 1 -0.95,-1.3; 2 0,-1.3; 3 0.95,-1.3; 4 0.95,1.3; 5 -0.95,1.3
STAND-OFF-M2.5 = hole 2.54: 0,0
HW4-SMD-2.0 = smd 1 x 2.5: 1 -3,0; 2 -1,0; 3 1,0; 4 3,0 | smd 2 x 2.5: SS1 -5.8,3.123; SS2 5.8,3.123
2X3 = drill 1.016 pad 1.88: 1 0,0; 2 0,2.54; 3 2.54,0; 4 2.54,2.54; 5 5.08,0; 6 5.08,2.54
JST-2-SMD = smd 1 x 4.6: 1 -1,-3.7; 2 1,-3.7 | smd 1.6 x 3.4: NC1 -3.4,1.5; NC2 3.4,1.5
1X06_LOCK = drill 1.016 pad 1.88: 1 0,0; 2 2.54,-0.254; 3 5.08,0; 4 7.62,-0.254; 5 10.16,0; 6 12.7,-0.254
SMT-JUMPER_2_NC_PASTE_SILK = smd 0.635 x 1.27: 1 -0.406,0; 2 0.406,0
STAND-OFF = hole 3.302: 0,0
PARTICLE-DEVICES_BORON = drill 1.016 pad 1.88: 3V3 1.27,41.91; A0 1.27,34.29; A1 1.27,31.75; A2 1.27,29.21; A3 1.27,26.67; A4 1.27,24.13; A5 1.27,21.59; D2 21.59,11.43; D3 21.59,13.97; D4 21.59,16.51; D5 21.59,19.05; D6 21.59,21.59; D7 21.59,24.13; D8 21.59,26.67; EN 21.59,31.75; GND 1.27,36.83; LI+ 21.59,34.29; MD 1.27,39.37; MI 1.27,13.97; MO 1.27,16.51; NC 1.27,6.35; RST 1.27,44.45; RX 1.27,11.43; SCK 1.27,19.05; SCL 21.59,8.89; SDA 21.59,6.35; TX 1.27,8.89; VUSB 21.59,29.21 | hole 2.54: 2.54,2.54; 20.32,2.54; 20.32,48.26; 2.54,48.26
SOT23 = smd 1 x 1.4: 1 -0.95,-1.1; 2 0.95,-1.1; 3 0,1.1
0805 = smd 0.8 x 1.2: 1 -0.9,0; 2 0.9,0
SWITCH_DPDT_SMD_AYZ0202 = smd 1 x 1.15: 1 -2.5,2.825; 2 0,2.825; 3 2.5,2.825; 4 -2.5,-2.825; 5 0,-2.825; 6 2.5,-2.825 | hole 0.85: 1.5,0; -1.5,0
TACT6MM = smd 1.55 x 1.3: P$1 -3.975,2.45; P$2 3.975,2.45; P$3 -3.975,-2.45; P$4 3.975,-2.45
RJ_5 = smd 1.473 x 0.559: 1 -1.118,0.95; 2 -1.118,0; 3 -1.118,-0.95; 4 1.118,-0.95; 5 1.118,0.95
SOIC127P600X175-8N = smd 1.473 x 0.559: 1 -2.819,1.905; 2 -2.819,0.635; 3 -2.819,-0.635; 4 -2.819,-1.905; 5 2.819,-1.905; 6 2.819,-0.635; 7 2.819,0.635; 8 2.819,1.905
TSOT-23 = smd 1.1 x 0.6: 1 -1.35,0.95; 2 -1.35,0; 3 -1.35,-0.94; 4 1.35,-0.95; 5 1.35,0; 6 1.35,0.95
SOT-23-6 = smd 1.27 x 0.559: 1 -1.295,0.94; 2 -1.295,0; 3 -1.295,-0.94; 4 1.295,-0.94; 5 1.295,0; 6 1.295,0.94
SOP50P310X90-8N = smd 1.067 x 0.254: 1 -1.422,0.762; 2 -1.422,0.254; 3 -1.422,-0.254; 4 -1.422,-0.762; 5 1.422,-0.762; 6 1.422,-0.254; 7 1.422,0.254; 8 1.422,0.762
SOIC8-N_MC = smd 1.981 x 0.559: 1 -2.362,1.905; 2 -2.362,0.635; 3 -2.362,-0.635; 4 -2.362,-1.905; 5 2.362,-1.905; 6 2.362,-0.635; 7 2.362,0.635; 8 2.362,1.905
0805' = smd 1.118 x 1.448: 1 -0.902,0; 2 0.902,0
XTAL_ECS-.327-6-17X-TR = smd 1.3 x 1.9: 1 -2.75,-1.6; 2 2.75,-1.6; 3 2.75,1.6; 4 -2.75,1.6

### Placement (x,y rotation side)
C1  8.61,15.29 0 top
C2  28.45,12.7 90 top
C3  57.15,13.97 0 top
C4  78.74,19.05 180 top
C5  60.96,19.05 180 top
C6  81.28,25.4 90 top
C7  63.5,25.4 90 top
C8  76.2,8.64 180 bottom
C11  24.13,22.86 0 top
C12  24.13,15.24 0 top
D1  67.31,25.4 270 top
D2  71.12,25.4 270 top
D3  67.56,21.08 180 top
F1  82.3,20.57 270 top
F2  9.32,34.8 90 top
F3  35.76,4.78 270 top
FD1  85.7,37.77 0 top
FD2  2.36,1.37 0 top
FRAME1  0.03,-11.81 0 top  (outside the outline)
FRAME2  -0.03,-7.98 0 top  (outside the outline)
FRAME3  90.42,19.28 0 top
G1  21.56,32.82 270 top
H1  5.41,10.52 0 top
H2  5.41,28.27 0 top
H3  51.13,10.52 0 top
H4  51.13,28.27 0 top
J1  45.49,6.76 180 bottom
J2  28.83,2.74 0 bottom
J3  14.55,6.76 180 bottom
J4  77.72,34.29 0 bottom
J5  60.2,34.29 0 bottom
J6  44.22,31.88 0 bottom
J7  28.22,35.92 0 bottom
JP1  32.97,18.29 90 top
JP3  85.85,33.6 0 top
JP4  85.85,5.03 90 top
JP5  4.45,33.6 0 top
JP6  4.45,5.03 0 top
JP7  74.17,21.08 270 bottom
P1  2.87,7.95 90 bottom
Q1  26.67,26.67 270 top
Q2  34.04,26.67 270 top
R1  44.45,19.05 90 top
R2  41.91,19.05 90 top
R3  35.18,19.05 270 top
R4  7.62,24.13 0 top
R5  9.91,26.42 180 top
R6  57.15,8.89 180 top
R7  57.15,11.43 0 top
R8  78.74,26.16 180 top
R9  60.96,26.16 180 top
R20  22.86,26.67 90 top
R21  29.97,26.67 270 top
R22  37.34,26.67 90 top
S1  69.09,33.27 270 bottom
SW1  63.5,8.13 270 bottom
U1  31.75,12.7 0 top
U2  8.56,19.05 180 top
U3  38.15,19.05 90 top
U4  60.96,22.86 90 top
U5  78.74,22.86 90 top
U7  34.29,23.11 180 top
U8  17.02,19.05 180 top
U$2  [OSHW-LOGO-M]  86.41,13.34 90 bottom
V1  VC080505C150DP  [0805']  83.31,16.76 180 top
V2  VC080505C150DP  [0805']  11.96,35.28 90 top
V3  VC080505C150DP  [0805']  32.92,4.55 90 top
Y1  26.67,19.05 0 top

### Tracks (layer width: path | path; a pad name or v marks a point on that pad's centre or on a via)
!RST  (via drill 0.35)
  Top 0.305: U3.6 36.75,19.95 R3.1 33.39,19.95 v33.27,20.07
  Bottom 0.305: v33.27,20.07 36.24,20.07 36.98,19.32 36.98,16.11 41.91,11.18 45.47,11.18 47.32,9.32 P1.RST
A0  (via drill 0.35)
  Bottom 0.305: P1.A0 39.62,6.76 J1.1 42.49,7.18 v42.52,7.21
A1  (via drill 0.35)
  Bottom 0.305: P1.A1 38.64,5.2 43.19,5.2 44.49,6.5 J1.2 v44.48,6.76
BATT-IN  (via drill 0.35)
  Top 0.305: U4.1 60.38,21.92 60.38,22.33 60.91,22.86 66.44,22.86 D1.ANODE | v56.64,26.16 49.56,26.16 44.94,30.79 18.86,30.79 18.14,30.06 18.14,26.43 21.59,22.98 21.59,20.83 20.45,19.68 U8.3
  Top 0.508: v58.42,22.86 59.72,21.57 U4.1
  Bottom 0.305: 58.42,26.16 v56.64,26.16 | 59.18,30.61 J5.2 59.2,28.96 | v59.18,31.75 59.18,30.61 | v59.18,28.96 59.18,30.61
  Bottom 0.508: 59.2,28.96 59.2,27.96 58.42,27.18 58.42,26.16 v58.42,22.86
D2  (via drill 0.35)
  Top 0.305: v24.33,33.76 22.88,33.76 G1.5
  Bottom 0.305: J7.3 23.14,34.95 v24.33,33.76 17.5,33.76 14.3,30.56 P1.D2
D3  (via drill 0.35)
  Top 0.305: P1.D3 18.54,31.24 22.24,31.24 G1.4 24.35,31.87 v24.36,31.88
  Bottom 0.305: J7.2 25.68,32.54 25.02,31.88 v24.36,31.88
DC-IN  (via drill 0.35)
  Top 0.508: U5.1 77.5,21.57 v75.95,23.11 75.33,23.73 D2.ANODE
  Bottom 0.305: v76.71,31.75 76.71,30.61 J4.2 76.71,30.57 v76.71,28.96
  Bottom 0.508: J4.2 76.72,27.7 75.95,26.92 v75.95,23.11 75.79,23.11 JP7.1
DEEP-SLEEP
  Top 0.305: R20.2 25.52,27.57 Q1.1 24.46,28.73 P1.D6
DELAY
  Top 0.305: R1.1 R2.1 39.54,18.15 U3.3
DONE  (via drill 0.35)
  Top 0.305: U3.4 39.1,19.64 38.51,19.05 v36.32,19.05
  Bottom 0.305: P1.A3 36.32,16 v36.32,19.05
EN
  Top 0.305: P1.EN 35.14,29.02 Q2.3
EN/UVLO  (via drill 0.35)
  Top 0.305: U5.3 79.68,19.09 | 79.68,19.09 C4.1 | U4.3 61.9,19.09 | 61.9,19.09 C5.1 | 61.9,19.09 61.94,19.05 v63.5,19.05 75.95,19.05 77.47,17.53 79.5,17.53 79.76,17.78 79.76,19.01 79.68,19.09
  Bottom 0.305: S1.2 66.26,33.24 64.77,31.75 64.77,20.32 v63.5,19.05
GND  (via drill 0.35)
  other vias: 32.26,2.29 30.48,1.78 24.13,13.97 24.13,11.94 28.96,22.86 24.13,25.4 26.42,22.86 80.26,31.75 80.26,28.96 62.74,31.75 62.74,28.96 80.52,20.32 39.62,3.56 51.31,3.56 48.51,6.6 20.32,3.81 17.53,6.6 8.76,3.68 38.35,35.05 50.04,35.05 41.22,31.72 34.29,12.95 29.46,10.92 65.53,19.81 84.07,18.29 84.07,15.24 85.09,18.29 80.26,30.23 62.74,30.23 38.61,10.92 39.62,10.92 40.64,10.92 33.78,2.29 40.64,7.62 11.18,33.02 12.19,33.02 13.46,34.54 30.23,35.05 30.23,36.58 61.21,31.75 61.21,28.96 78.74,31.75 78.74,28.96 18.29,32.77 57.91,19.81
  pour Top (rank 2): -3.78,41.42 97.47,41.61 97.41,-1.99 -3.78,-2.18
  pour Bottom: -3.57,41.21 97.01,41.05 96.82,-2.41 -3.38,-2.39
LI+  (via drill 0.35)
  Top 0.305: R22.2 37.16,27.75 P1.LI+ | U7.8 32.14,22.35 29.97,24.52 v29.97,24.64 R21.2
  Top 0.508: P1.LI+ 45.39,29.54 49.78,25.15 59.04,25.15 R9.2 60.06,24.2 U4.6
  Bottom 0.305: P1.LI+ 32.26,24.64 v29.97,24.64
MISO
  Bottom 0.305: P1.MI 17.62,9.22 22.8,4.04 24.99,4.04 J2.3
MOSI
  Bottom 0.305: P1.MO 19.81,9.22 J2.6
N$1  (via drill 0.35)
  Top 0.508: D3.C 70.1,21.08 70.61,20.57 v71.53,20.57
  Bottom 0.508: JP7.2 74.07,20.57 v71.53,20.57
N$4  (via drill 0.35)
  Top 0.305: R7.2 R6.1 59.69,8.89 v60.96,7.62
  Bottom 0.305: SW1.P$2 61.05,7.53 v60.96,7.62 60.96,12.01 SW1.P$1
N$5
  Top 0.305: C6.1 80.02,24.5 U5.4
N$6
  Top 0.305: R8.1 78.74,25.26 U5.5
N$7
  Top 0.508: R8.2 77.8,26.12 U5.6 77.8,23.04 77.98,22.86 81.41,22.86 F1.1
N$9  (via drill 0.35)
  Top 0.305: D2.CATHODE D1.CATHODE 66.04,28.34 v66.04,29.21
  Bottom 0.305: v66.04,29.21 66.04,30.55 S1.3
N$10
  Top 0.305: U4.4 62.24,24.5 C7.1
N$12
  Top 0.305: R9.1 60.96,25.26 U4.5
N$13
  Top 0.305: Q2.1 34.04,26.52 34.04,25.03 34.49,24.57 34.49,23.67 34.8,23.37 U7.3
N$14
  Top 0.305: Q1.3 28.67,27.57 R21.1 31.5,26.05 31.5,25.4 32.26,24.64 33.78,24.64 34.04,24.38 34.04,23.62 33.78,23.37 U7.6
N$15
  Top 0.305: U8.1 21.32,17.14 C12.1 23.92,15.93 Y1.1
N$16
  Top 0.305: U8.2 21.68,18.41 Y1.4 23.23,21.34 C11.1
N$17  (via drill 0.35)
  other vias: 74.42,35.81
N$18  (via drill 0.35)
  other vias: 81.28,35.81
NC1  (via drill 0.35)
  other vias: 63.5,35.81
NC2  (via drill 0.35)
  other vias: 56.82,35.76
RTC-INT  (via drill 0.35)
  Top 0.305: U8.7 13.08,18.41 v12.7,18.8 | v21.84,24.64 28.96,24.64 32,21.59 33.78,21.59 34.04,21.84 | U7.7 33.78,22.86 34.04,22.61 34.04,21.84 | 34.04,21.84 34.29,21.59 36.07,21.59 37.34,22.86 R22.1
  Bottom 0.305: v12.7,18.8 12.7,23.11 14.22,24.64 v21.84,24.64
RX  (via drill 0.35)
  Bottom 0.305: P1.RX 13.84,9.22 11.55,6.94 J3.1 v11.56,6.6
SCK
  Bottom 0.305: P1.SCK 22.35,9.22 J2.4
SCL  (via drill 0.35)
  Top 0.305: J6.1 47.09,32 46.11,32 45.4,31.29 45.02,31.29 43.69,32.62 22.06,32.62 21.3,31.87 G1.3 14.09,31.87 P1.SCL | U2.6 6.73,19.68 10.92,23.88 | 10.92,23.88 v10.92,24.64 10.92,26.3 R5.1 | U8.6 13.34,19.68 12.7,20.32 12.7,23.11 11.94,23.88 10.92,23.88
  Bottom 0.305: v10.92,24.64 11.76,25.48 P1.SCL 11.76,29.78 16.2,34.21 19.15,34.21 J7.4
  other vias: 47.22,31.88
SDA  (via drill 0.35)
  Top 0.305: U2.5 5.74,22.64 6.72,23.62 R4.1 6.72,23.88 7.74,22.86 8.89,22.86 9.96,23.93 9.96,28 10.41,28.45 | v45.23,32.27 45.2,32.27 44.37,33.1 21.8,33.1 21.13,33.77 G1.1 18.03,33.77 | 18.03,33.77 13.96,33.77 9.73,29.54 P1.SDA 9.32,29.54 10.41,28.45 | U8.5 13.16,22.45 13.16,23.3 12.19,24.27 12.19,26.67 10.41,28.45 | J7.5 18.06,33.79 18.03,33.77
  Bottom 0.305: v45.23,32.27 J6.2
SS
  Bottom 0.305: P1.A5 24.89,9.22 J2.2
TEMP
  Top 0.305: U1.1 29.93,13.65 28.92,12.64 27.63,12.64 26.92,11.94 26.92,9.3 P1.A4
TX  (via drill 0.35)
  Bottom 0.305: P1.TX 10.16,7.62 10.16,5.59 11.43,4.32 12.7,4.32 13.55,5.17 J3.2 13.56,6.75 v13.56,6.66
USER-SW
  Top 0.305: R7.1 C3.1 54.47,15.75 32.51,15.75 31.5,16.76 31.5,21.34 28.96,23.88 21.34,23.88 19.38,25.83 P1.D4
VCC  (via drill 0.35)
  Top 0.305: R6.2 54.1,8.89 52.83,7.62 46.56,7.62 44.96,9.22 P1.3V3 | 35.56,14.73 35.56,12.7 34.61,11.75 U1.4 31.92,12.7 U1.2 29.63,12.7 28.73,11.8 C2.1 | R3.2 34.63,18.69 JP1.2 32.38,19.28 v32.38,20.06 | 14.73,17.07 14.73,12.95 | 3.81,17.27 3.94,17.14 U2.8 5.74,15.6 6.1,15.24 7.66,15.24 C1.1 | 7.87,26.42 R5.2 9.01,24.62 R4.2
  Top 0.508: F3.1 42.75,6.17 44.78,8.2 P1.3V3 | F2.1 9.32,32.31 7.87,30.86 7.87,26.42 6.86,25.4 4.83,25.4 3.81,24.38 3.81,17.27 3.81,13.72 4.57,12.95 14.73,12.95 25.15,12.95 26.92,14.73 v33.78,14.73 35.56,14.73 39.45,14.73 44.96,9.22 | U8.8 14.73,17.07
  Bottom 0.305: v33.78,14.73 32.38,16.13 v32.38,20.06
VCC2-EXT  (via drill 0.35)
  Top 0.508: F2.2 11.95,36.2 V2.2 15,36.18 J7.6 17.83,37.97 39.37,37.97 43.18,34.16 v43.18,34.04
  Bottom 0.305: J6.3 43.26,31.84 v43.26,31.75
  Bottom 0.508: v43.18,34.04 43.22,33.99 J6.3
VCC-EXT  (via drill 0.35)
  Top 0.508: J1.3 46.49,6.85 46.48,6.86 46.48,4.83 42.42,0.76 38.38,0.76 F3.2 33.69,5.45 V3.2 31.86,5.45 31.5,5.08 31.5,1.52 30.73,0.76 24.89,0.76 23.75,1.91 | J2.5 23.75,1.91 | 23.75,1.91 22.61,0.76 18.8,0.76 15.49,4.06 15.49,6.7 J3.3
  other vias: 46.49,6.76 15.55,6.76
VDD
  Top 0.305: JP1.1 33.17,17.88 33.78,17.27 36.77,17.27 U3.1
VUSB  (via drill 0.35)
  Top 0.508: F1.2 82.3,16.88 V1.2 79.5,16.76 v76.2,13.46 73.41,16.26 57.4,16.26 45.21,28.45 v40.64,28.45
  Bottom 0.508: v76.2,13.46 C8.P$1 | P1.VUSB 33.53,30.99 38.1,30.99 v40.64,28.45
WAKE  (via drill 0.35)
  Top 0.305: v32.8,20.86 36.1,20.86 37.08,21.84 37.85,21.84 38.15,21.54 U3.5
  Bottom 0.305: P1.D8 29.54,25.14 29.31,24.91 29.31,24.28 32.77,20.83 v32.8,20.86

### Text on the board
bNames: GND D3 D2 SCL SDA Vcc | SCL SDA VCC GND | Power Switch | v1.1- 10-29-19 | chip@seeinsights.com | + | ON | + | LiPO Battery | DC - IN | Over Voltage Protection / Must be connected for / Argon / Xenon. Optional / for Boron | User Btn | SS SCK MOSI | 1 Hour Watchdog | GND Vcc Rx Tx | GND MISO VCC | GND Vcc A1 A0